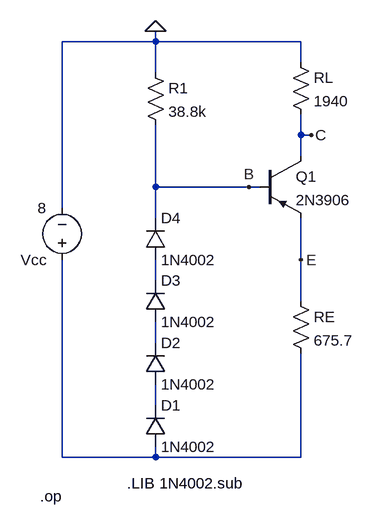
[diagram p0: schematic plt3.asc]
plt3.asc, the LTspice schematic file:
Version 4
SHEET 1 880 680
WIRE 48 -400 48 -416
WIRE 48 -400 -96 -400
WIRE 272 -400 48 -400
WIRE 272 -368 272 -400
WIRE 48 -352 48 -400
WIRE 272 -256 272 -288
WIRE 288 -256 272 -256
WIRE 272 -224 272 -256
WIRE 48 -176 48 -272
WIRE 192 -176 48 -176
WIRE 208 -176 192 -176
WIRE -96 -144 -96 -400
WIRE 48 -128 48 -176
WIRE 272 -64 272 -128
WIRE 48 -32 48 -64
WIRE 272 0 272 -64
WIRE 48 64 48 32
WIRE 48 160 48 128
WIRE -96 240 -96 -64
WIRE 48 240 48 224
WIRE 48 240 -96 240
WIRE 272 240 272 80
WIRE 272 240 48 240
FLAG 288 -256 C
FLAG 192 -176 B
FLAG 272 -64 E
FLAG 48 -416 0
SYMBOL diode 32 -64 M180
WINDOW 0 24 64 Left 2
WINDOW 3 24 0 Left 2
SYMATTR InstName D4
SYMATTR Value 1N4002
SYMBOL diode 32 32 M180
WINDOW 0 24 64 Left 2
WINDOW 3 24 0 Left 2
SYMATTR InstName D3
SYMATTR Value 1N4002
SYMBOL diode 32 128 M180
WINDOW 0 24 64 Left 2
WINDOW 3 24 0 Left 2
SYMATTR InstName D2
SYMATTR Value 1N4002
SYMBOL diode 32 224 M180
WINDOW 0 24 64 Left 2
WINDOW 3 24 0 Left 2
SYMATTR InstName D1
SYMATTR Value 1N4002
SYMBOL res 256 -384 R0
SYMATTR InstName RL
SYMATTR Value 1940
SYMBOL res 32 -368 R0
SYMATTR InstName R1
SYMATTR Value 38.8k
SYMBOL voltage -96 -48 R180
WINDOW 123 0 0 Left 0
WINDOW 39 0 0 Left 0
SYMATTR InstName Vcc
SYMATTR Value 8
SYMBOL res 256 -16 R0
SYMATTR InstName RE
SYMATTR Value 675.7
SYMBOL pnp 208 -224 R0
SYMATTR InstName Q1
SYMATTR Value 2N3906
TEXT 4 280 Left 2 !.LIB 1N4002.sub
TEXT -130 300 Left 2 !.op

The netlist it stands for:
* plt3.asc
D4 N001 B 1N4002
D3 N002 N001 1N4002
D2 N003 N002 1N4002
D1 N004 N003 1N4002
RL 0 C 1940
R1 0 B 38.8k
Vcc N004 0 8
RE E N004 675.7
Q1 C B E 0 2N3906
.model D D
.lib standard.dio
.model NPN NPN
.model PNP PNP
.lib standard.bjt
.LIB 1N4002.sub
.op
.backanno
.end